# Altium schematic sheet Lower.SchDoc
size A4
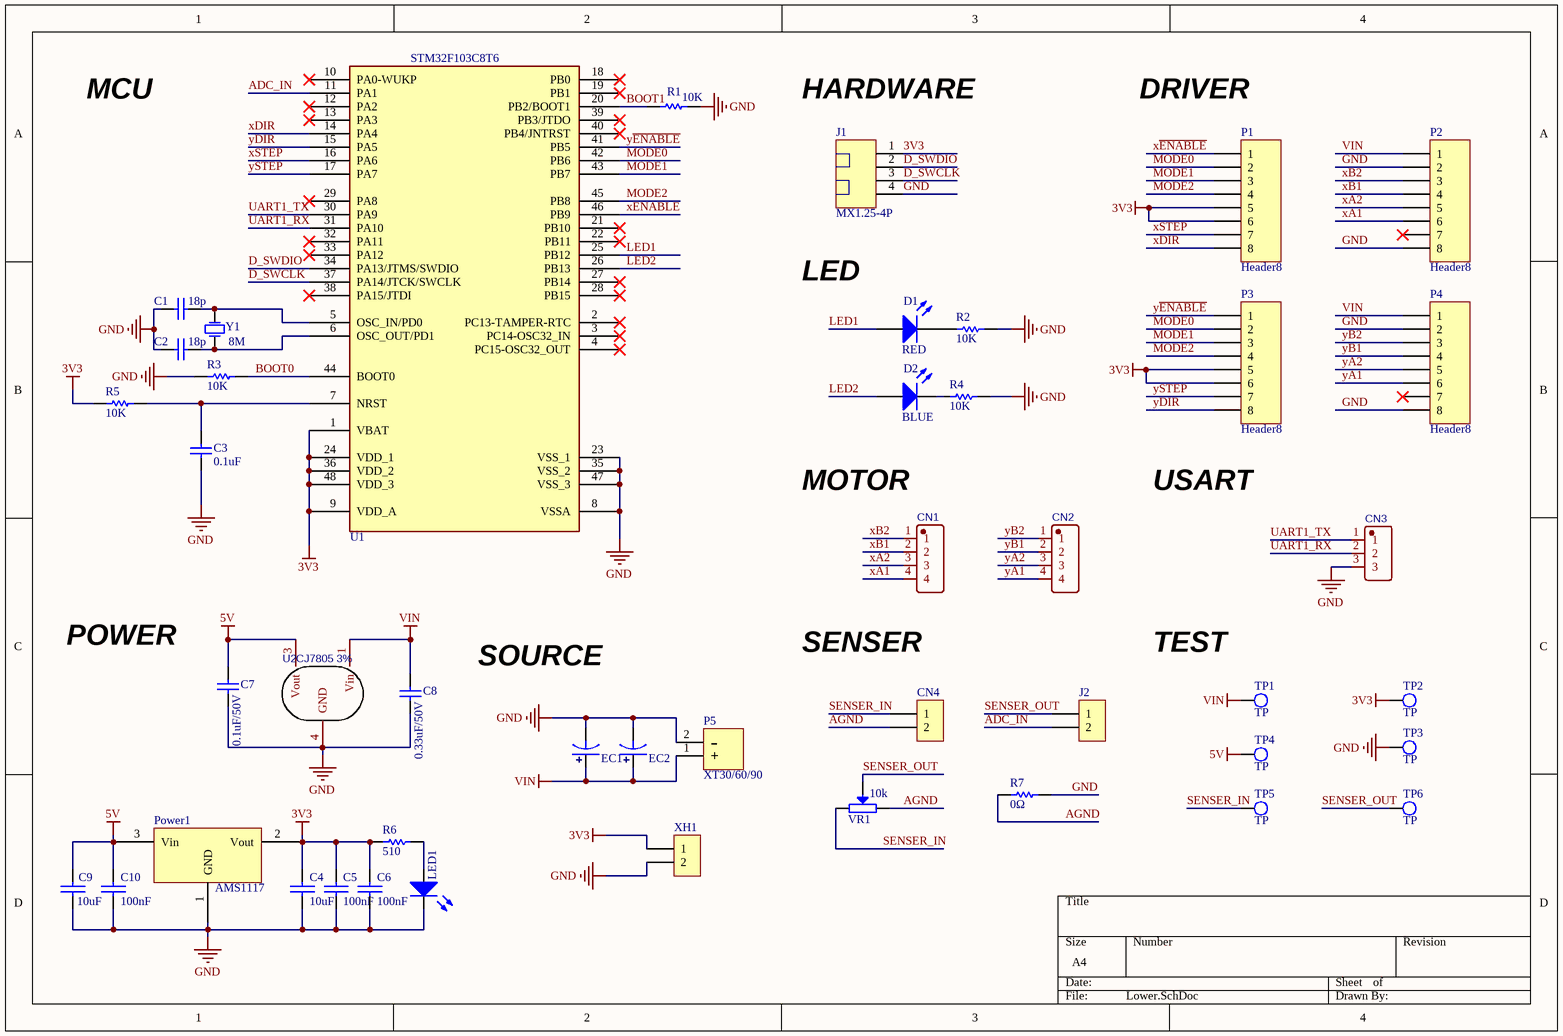
[diagram p0: Lower.SchDoc]

## Parts
C1  value 18p  [0603C]  (hidden comment: Cap)
C2  value 18p  [0603C]  (hidden comment: Cap)
C3  value 0.1uF  [0603C]  (hidden comment: C0603)
C4  10uF  [0805c]
C5  100nF  [0603C]
C6  100nF  [0603C]
C7  0.1uF/50V  [0603C]
C8  0.33uF/50V  [0603C]
C9  10uF  [0805c]
C10  100nF  [0603C]
CN1  HX25003-4A  [XH4/2.54mm/90]  (value not drawn)
CN2  HX25003-4A  [XH4/2.54mm/90]  (value not drawn)
CN3  X8821WR-03S-N0SN  [XH3/2.54mm/90]  (value not drawn)
CN4  XH2  [XH2/2.54mm/90]  (value not drawn)
D1  RED  [0603LED_B]
D2  BLUE  [0603LED_B]
EC1  DIP_ECAP  [DIP-EC2.0X5X11-A]  (value not drawn)
EC2  DIP_ECAP  [DIP-EC2.0X5X11-A]  (value not drawn)
J1  MX1.25-4P  [MX1.25WS-4P]
J2  Pin HDR1X2  [Pin HDR1X2/2.54mm-S]  (value not drawn)
LED1  LED_RED  [0603LED_R]  (value not drawn)
P1  Header8  [HEADER 8x1]
P2  Header8  [HEADER 8x1]
P3  Header8  [HEADER 8x1]
P4  Header8  [HEADER 8x1]
P5  XT30/60/90  [XT30PW-Male]
Power1  AMS1117  [SOT223]
R1  value 10K  [0603R]  (hidden comment: R0603)
R2  value 10K  [0603R]  (hidden comment: R0603)
R3  value 10K  [0603R]  (hidden comment: R0603)
R4  value 10K  [0603R]  (hidden comment: R0603)
R5  value 10K  [0603R]  (hidden comment: R0603)
R6  510  [0603R]
R7  0Ω  [0603R]
TP1  TP  [TP_SMT]
TP2  TP  [TP_SMT]
TP3  TP  [TP_SMT]
TP4  TP  [TP_SMT]
TP5  TP  [TP_SMT]
TP6  TP  [TP_SMT]
U1  STM32F103C8T6  [LQFP_48]
U2  CJ7805 3%  [7805-foot]
VR1  10k  [3296W]
XH1  XH2  [XH2/2.54mm/90]  (value not drawn)
Y1  8M  [NX5032GA]

## Nets
3V3: C4.2 C5.2 C6.2 J1.1 P1.5 P1.6 P3.5 P3.6 Power1.2(Vout) R5.2 R6.1 TP2.1(TP) U1.1(VBAT) U1.9(VDD_A) U1.24(VDD_1) U1.36(VDD_2) U1.48(VDD_3) XH1.1
5V: C7.1 C9.2 C10.2 Power1.3(Vin) TP4.1(TP) U2.3(Vout)
GND: C1.2 C2.2 C3.1 C4.1 C5.1 C6.1 C7.2 C8.2 C9.1 C10.1 CN3.3 EC1.2 EC2.2 J1.4 LED1.2 P2.2 P2.8 P4.2 P4.8 P5.2(-) Power1.1(GND) R1.1 R2.1 R3.2 R4.1 R7.2 TP3.1(TP) U1.8(VSSA) U1.23(VSS_1) U1.35(VSS_2) U1.47(VSS_3) U2.4(GND) XH1.2
VIN: C8.1 EC1.1 EC2.1 P2.1 P4.1 P5.1(+) TP1.1(TP) U2.1(Vin)
ADC_IN: J2.2 U1.11(PA1)
AGND: CN4.2 R7.1 VR1.2
BOOT0: R3.1 U1.44(BOOT0)
BOOT1: R1.2 U1.20(PB2/BOOT1)
D_SWCLK: J1.3 U1.37(PA14/JTCK/SWCLK)
D_SWDIO: J1.2 U1.34(PA13/JTMS/SWDIO)
LED1: D1.1(A) U1.25(PB12)
LED2: D2.1(A) U1.26(PB13)
MODE0: P1.2 P3.2 U1.42(PB6)
MODE1: P1.3 P3.3 U1.43(PB7)
MODE2: P1.4 P3.4 U1.45(PB8)
SENSER_IN: CN4.1 TP5.1(TP) VR1.1
SENSER_OUT: J2.1 TP6.1(TP) VR1.2
UART1_RX: CN3.2 U1.31(PA10)
UART1_TX: CN3.1 U1.30(PA9)
xA1: CN1.4 P2.6
xA2: CN1.3 P2.5
xB1: CN1.2 P2.4
xB2: CN1.1 P2.3
xDIR: P1.8 U1.14(PA4)
x~{ENABLE}: P1.1 U1.46(PB9)
xSTEP: P1.7 U1.16(PA6)
yA1: CN2.4 P4.6
yA2: CN2.3 P4.5
yB1: CN2.2 P4.4
yB2: CN2.1 P4.3
yDIR: P3.8 U1.15(PA5)
y~{ENABLE}: P3.1 U1.41(PB5)
ySTEP: P3.7 U1.17(PA7)
NetC1_1: C1.1 U1.5(OSC_IN/PD0) Y1.2(OSC2)
NetC2_1: C2.1 U1.6(OSC_OUT/PD1) Y1.1(OSC1)
NetC3_2: C3.2 R5.1 U1.7(NRST)
NetD1_2: D1.2(K) R2.2
NetD2_2: D2.2(K) R4.2
NetLED1_1: LED1.1 R6.2

Not connected (* = marked no-connect by the designer): P2 7*; P4 7*; U1 2(PC13-TAMPER-RTC)* 3(PC14-OSC32_IN)* 4(PC15-OSC32_OUT)* 10(PA0-WUKP)* 12(PA2)* 13(PA3)* 18(PB0)* 19(PB1)* 21(PB10)* 22(PB11)* 27(PB14)* 28(PB15)* 29(PA8)* 32(PA11)* 33(PA12)* 38(PA15/JTDI)* 39(PB3/JTDO)* 40(PB4/JNTRST)*

## Notes on the sheet
- MCU
- (near J1) HARDWARE
- (near P1) DRIVER
- LED
- MOTOR
- USART
- POWER
- SENSER
- TEST
- SOURCE

## Library data of the parts
C1 C2 = Cap: Capacitor; Published: 8-Jun-2000; LatestRevisionDate: 17-Jul-2002; LatestRevisionNote: Re-released for DXP Platform.; PackageReference: RAD-0.3; Publisher: Altium Limited; PackageDescription: Radial Cap, Thru-Hole; 2 Leads; 0.3 in Pin Spacing
C3 = C0603: Capacitor; Published: 8-Jun-2000; LatestRevisionDate: 17-Jul-2002; LatestRevisionNote: Re-released for DXP Platform.; PackageReference: RAD-0.3; Publisher: Altium Limited; PackageDescription: Radial Cap, Thru-Hole; 2 Leads; 0.3 in Pin Spacing
C4-C6 C9 C10 = CAP: 无极性电容
C7 C8 = Cap: Capacitor; Value: 100pF; Published: 8-Jun-2000; LatestRevisionDate: 17-Jul-2002; LatestRevisionNote: Re-released for DXP Platform.; PackageReference: RAD-0.3; Publisher: Altium Limited; PackageDescription: Radial Cap, Thru-Hole; 2 Leads; 0.3 in Pin Spacing
CN1 CN2 = HX25003-4A: BOM_Manufacturer: HX(Zhejiang Yueqing Hongxing Elec); Contributor: LCSC; BOM_Supplier: LCSC; BOM_Supplier Part: C442301; BOM_Manufacturer Part: HX25003-4A; spicePre: C; spiceSymbolName: HX25003-4A
CN3 = X8821WR-03S-N0SN: BOM_Manufacturer: XKB Enterprise; Contributor: LCSC; BOM_Supplier: LCSC; BOM_Supplier Part: C388740; BOM_Manufacturer Part: X8821WR-03S-N0SN; spicePre: C; spiceSymbolName: X8821WR-03S-N0SN
D1 D2 = D0603: Typical RED, GREEN, YELLOW, AMBER GaAs LED; Published: 8-Jun-2000; LatestRevisionDate: 17-Jul-2002; LatestRevisionNote: Re-released for DXP Platform.; PackageVersion: Feb-2002; PackageReference: 3.2X1.6X1.1; Publisher: Altium Limited; PackageDescription: SM LED; 2 Flat Leads
EC1 EC2 = DIP_ECAP: 直插电解电容
LED1 = LED: Typical RED, GREEN, YELLOW, AMBER GaAs LED; Published: 8-Jun-2000; LatestRevisionDate: 17-Jul-2002; LatestRevisionNote: Re-released for DXP Platform.; PackageVersion: Feb-2002; PackageReference: 3.2X1.6X1.1; Publisher: Altium Limited; PackageDescription: SM LED; 2 Flat Leads
P1-P4 = Header 8
Power1 = AMS1117: 三端稳压芯片
R1-R5 = R0603: Resistor; Published: 8-Jun-2000; LatestRevisionDate: 17-Jul-2002; LatestRevisionNote: Re-released for DXP Platform.; PackageReference: AXIAL-0.3; Publisher: Altium Limited; PackageDescription: Axial Device, Thru-Hole; 2 Leads; 0.3 in Pin Spacing
R6 R7 = RES
TP1-TP6 = TP: Test Point
U1 = STM32F103C8T6: LowPower MCU
U2 = CJ7805 3%: BOM_Manufacturer: CJ; SMT Type: Extend; BOM_Supplier: LCSC; BOM_Manufacturer Part: CJ7805 3%; image: //image.lceda.cn/szlcsc/C21706.jpg; BOM_Supplier Part: C21706; BOM_LCSC Assembly: Yes; spicePre: U; spiceSymbolName: CJ7805 3%
VR1 = RESVR
Y1 = XTAL: Crystal Oscillator; Published: 8-Jun-2000; LatestRevisionDate: 17-Jul-2002; LatestRevisionNote: Re-released for DXP Platform.; PackageReference: R38; Publisher: Altium Limited; PackageDescription: Crystal, Thru-Hole; 2 Leads; Body 3.1 x 8.2 mm (Dia.xH)